# EAGLE schematic pre_schematic_v1 (EAGLE 9.7.0)
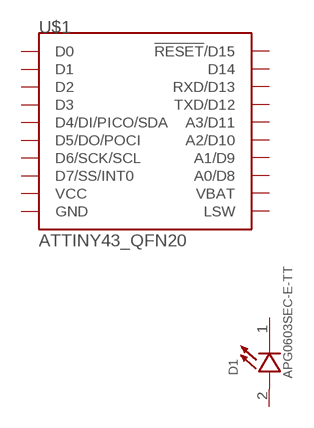
[diagram p0: schematic, sheet 1]

## Parts
D1  APG0603SEC-E-TT  [LED_APG0603SEC-E-TT]
U$1  ATTINY43_QFN20  [QFN20_20M1]
Unconnected: D1.1(C) D1.2(A) U$1.1(D2) U$1.2(D3) U$1.3(D4/DI/PICO/SDA) U$1.4(D5/DO/POCI) U$1.5(D6/SCK/SCL) U$1.6(D7/SS/INT0) U$1.11(A0/D8) U$1.12(A1/D9) U$1.13(A2/D10) U$1.14(A3/D11) U$1.15(TXD/D12) U$1.16(RXD/D13) U$1.17(D14) U$1.18(!RESET!/D15) U$1.19(D0) U$1.20(D1)

## Power pins joined to a net without a drawn wire
GND: U$1.8(GND) U$1.PAD(GND)
LSW: U$1.9(LSW)
VBAT: U$1.10(VBAT)
VCC: U$1.7(VCC)

## Library data of the parts
D1 = APG0603SEC-E-TT:APG0603SEC-E-TT: Check availability <https://pricing.snapeda.com/parts/APG0603SEC-E-TT/Kingbright/view-part?ref=eda>; AVAILABILITY: In Stock; CHECK_PRICES: https://www.snapeda.com/parts/APG0603SEC-E-TT/Kingbright/view-part/?ref=eda; DESCRIPTION: Red 624nm LED Indication - Discrete 1.93V 2-SMD, 0201; MF: Kingbright; MP: APG0603SEC-E-TT; PACKAGE: 0201 Kingbright; PRICE: None; SNAPEDA_LINK: https://www.snapeda.com/parts/APG0603SEC-E-TT/Kingbright/view-part/?ref=snap
U$1 = SparkFun-IC-Microcontroller:ATTINY43: ATtiny43 Pin 4 is COPI and Pin 5 is CIPO when the chip is in peripheral mode or is being programmed Pin 4 is CIPO and Pin 5 is COPI when the chip is operating in controller mode The #defines in the ATTinyCore assume controller mode; DIGIKEY_PART: ATTINY43U-MU-ND; MANU_PART: ATtiny43U-MU; PROD_ID: IC-16068